# Altium schematic sheet BMS-S08-V01-TemperatureSensorInterface.SchDoc: Extra Temperature Connection
size A3; DrawnBy: Jonn Dillon; DocumentNumber: 8; Revision: 01; SheetNumber: 8; SheetTotal: 10; Version: 01; Project: Battery Managment System 2020; PageSetup: Record=PageOptions|CenterHorizontal=True|CenterVertical=True|PrintScale=0.97|XCorrection=1.00|YCorrection=1.00|PrintKind=0|BorderSize=5000000|LeftOffset=0|BottomOffset=0|Orientation=2|PaperLength=1000|PaperWidth=1000|Scale=100|PaperSource=7|PrintQuality=-4|MediaType=1|DitherType=10|PaperKind=A4|PrintScaleMode=1
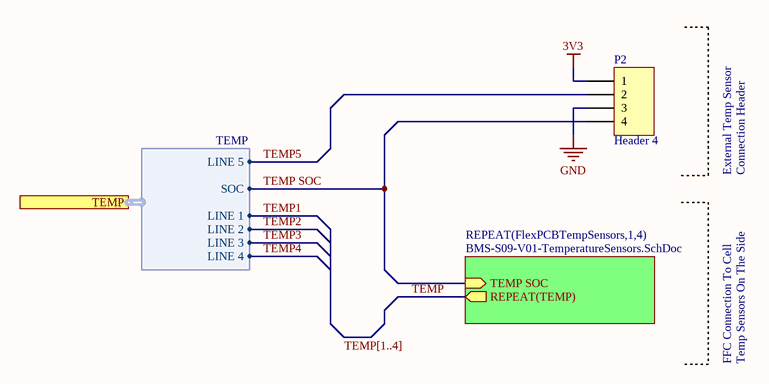
[diagram p0: BMS-S08-V01-TemperatureSensorInterface.SchDoc]

## Parts
P2  Header 4  [HDR1X4]

## Sub-sheets
REPEAT(FlexPCBTempSensors,1,4) = BMS-S09-V01-TemperatureSensors.SchDoc: REPEAT(TEMP) (out), TEMP SOC (in)

## Ports
TEMP (harness TEMP)

## Harnesses
TEMP: LINE 1, LINE 2, LINE 3, LINE 4, LINE 5, SOC

## Nets
3V3: P2.1
GND: P2.3
TEMP: sheet REPEAT(FlexPCBTempSensors,1,4)/REPEAT(TEMP)
TEMP1: port TEMP.LINE 1
TEMP2: port TEMP.LINE 2
TEMP3: port TEMP.LINE 3
TEMP4: port TEMP.LINE 4
TEMP5: P2.2 ; port TEMP.LINE 5
TEMP SOC: P2.4 ; sheet REPEAT(FlexPCBTempSensors,1,4)/TEMP SOC, port TEMP.SOC

## Buses and harness runs
bus TEMP[1..4]

## Notes on the sheet
- External Temp Sensor
- Connection Header
- FFC Connection To Cell
- Temp Sensors On The Side
- Revision History:
- Sheet Title:
- Rev
- Date
- Description
- Project:
- Size:
- Drawn By:
- A3
- Number:
- Revision:
- Sheet
- Version:
- of
- QUT Motorsport
- O-120, Gardens Point
- 2 George Street
- Brisbane, QLD 4000
- Australia
- Print Date:
- Print Time:
- File Name:

## Library data of the parts
P2 = Header 4: Header, 4-Pin; LatestRevisionDate: 17-Jul-2002; LatestRevisionNote: Re-released for DXP Platform.; Publisher: Altium Limited